# Altium project BinarX Rocket Payload Microcontroller.PrjPcb
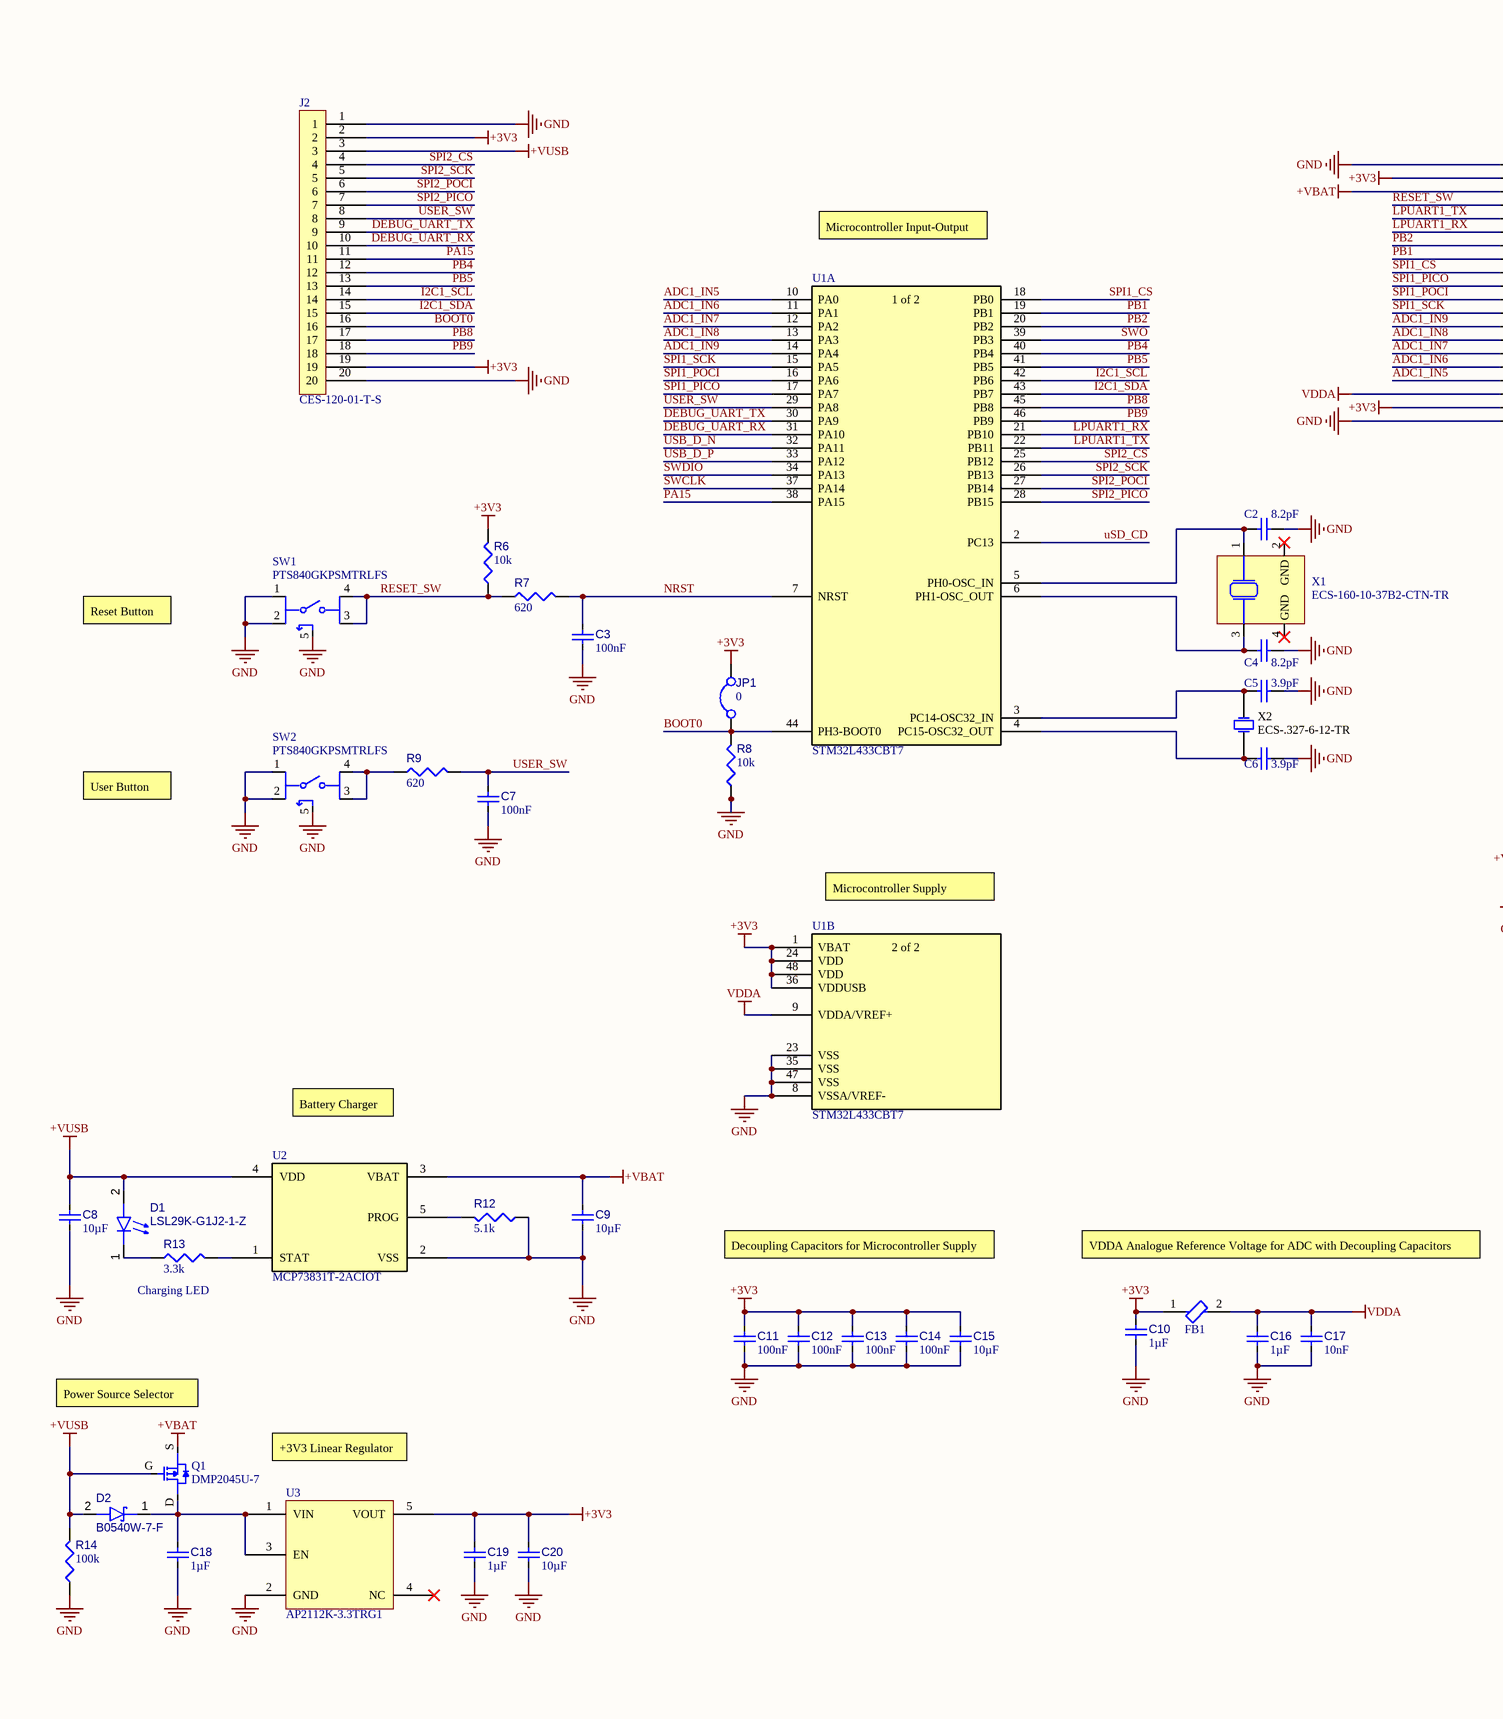
[diagram p0: Microcontroller Board.SchDoc, left]
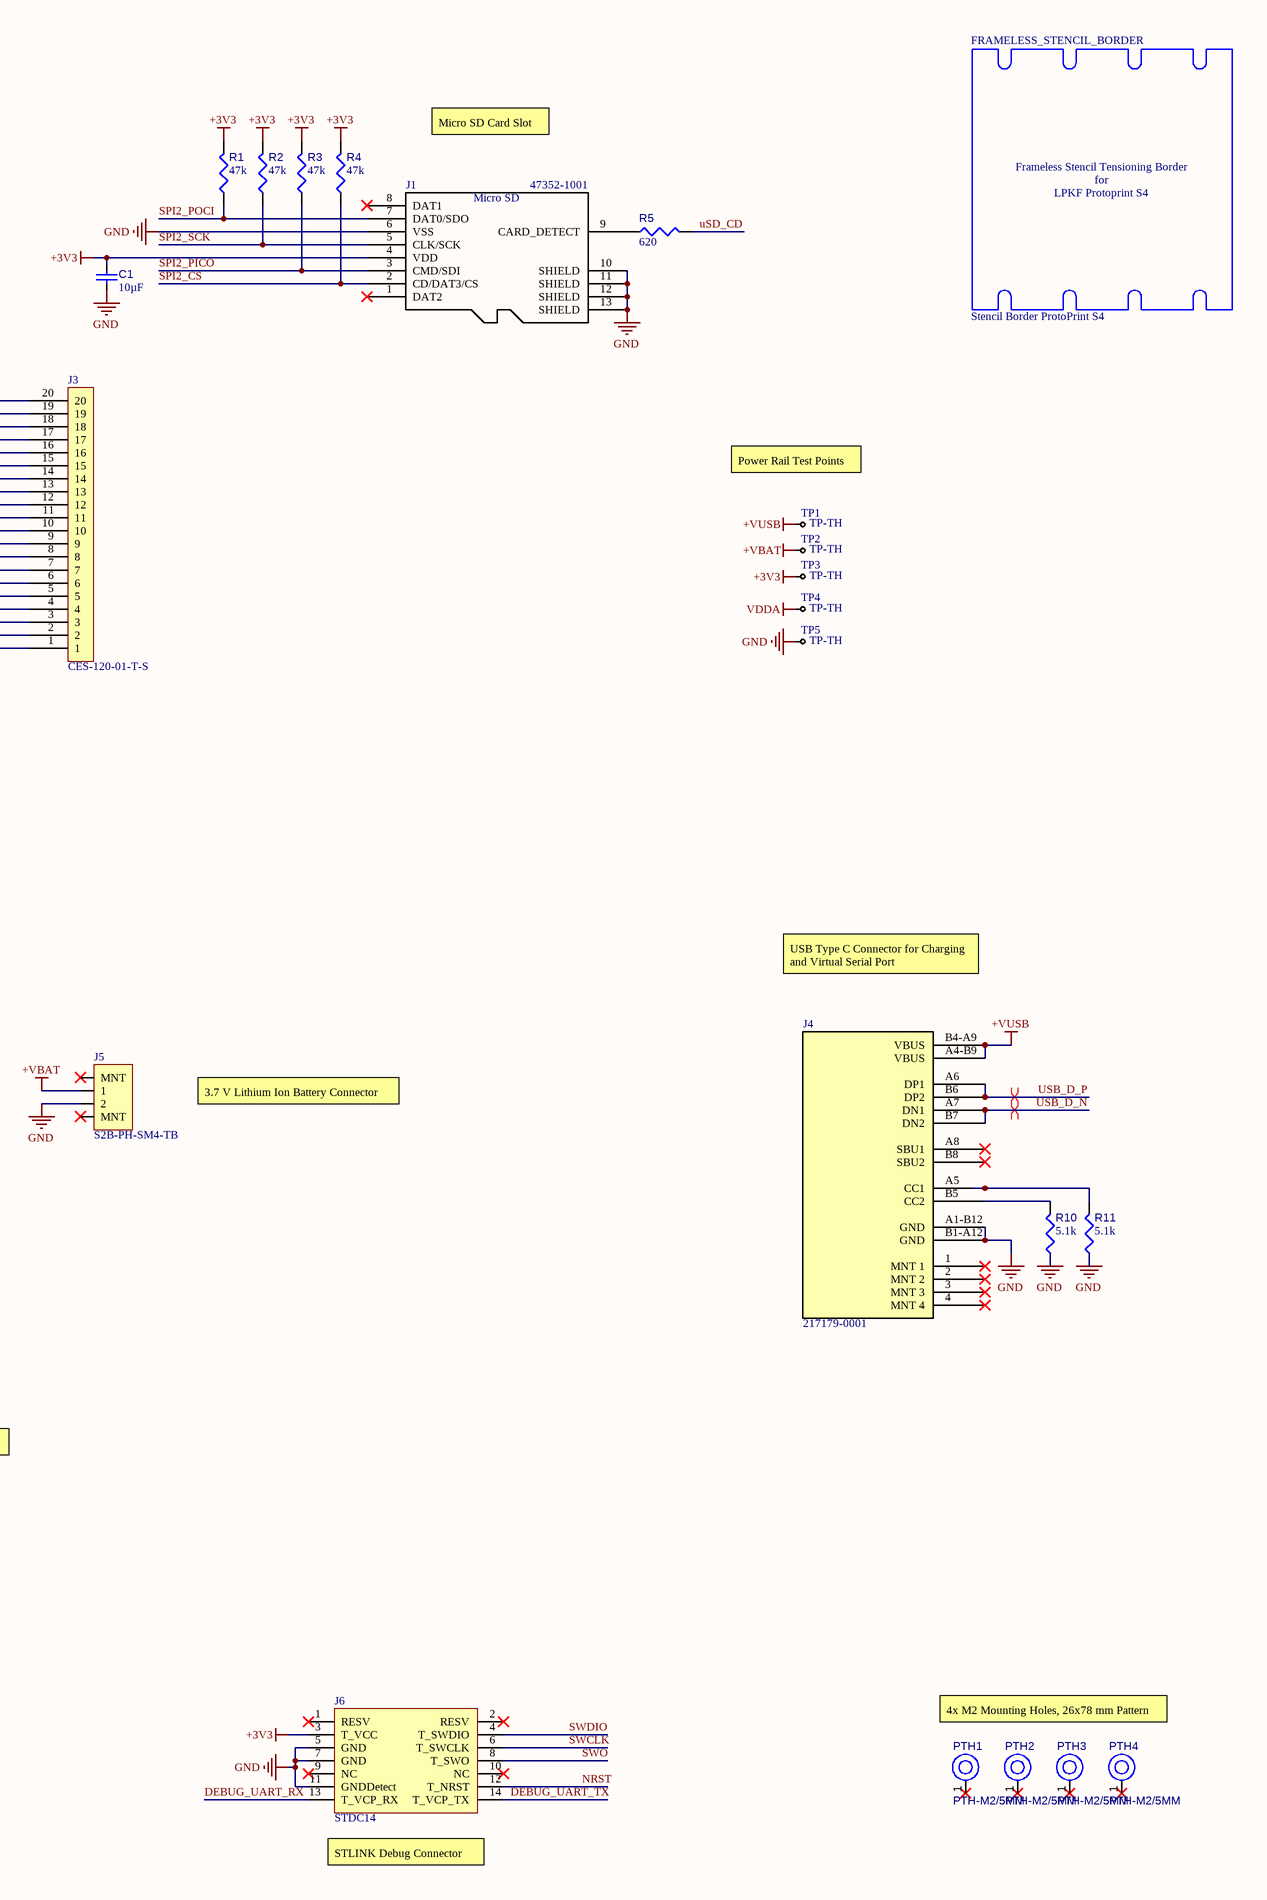
[diagram p1: Microcontroller Board.SchDoc, right]
1 sheet, 62 parts. Net scope: global (net labels, ports and power ports of the same name join across sheets).
Board file: Microcontroller Board.PcbDoc

## Sheet Microcontroller Board.SchDoc
size A2; SheetNumber: 1; SheetTotal: 1

### Parts
C1  value 10µF  [CAPC1608X90X40ML10T20]  (hidden comment: 10 uF +/- 10% 16 V 0603)
C2  value 8.2pF  [CAPC1608X90X40NL10T20]  (hidden comment: Capacitor 8.2 pF 10% 50 V 0603)
C3  value 100nF  [CAPC1608X90X40ML10T20]  (hidden comment: Capacitor 100 nF +/-10% 50 V 0603)
C4  value 8.2pF  [CAPC1608X90X40NL10T20]  (hidden comment: Capacitor 8.2 pF 10% 50 V 0603)
C5  value 3.9pF  [CAPC1608X90X40NL10T20]  (hidden comment: 3.9 pF 10% 50 V 0603)
C6  value 3.9pF  [CAPC1608X90X40NL10T20]  (hidden comment: 3.9 pF 10% 50 V 0603)
C7  value 100nF  [CAPC1608X90X40ML10T20]  (hidden comment: Capacitor 100 nF +/-10% 50 V 0603)
C8  value 10µF  [CAPC1608X90X40ML10T20]  (hidden comment: 10 uF +/- 10% 16 V 0603)
C9  value 10µF  [CAPC1608X90X40ML10T20]  (hidden comment: 10 uF +/- 10% 16 V 0603)
C10  value 1µF  [CAPC1608X90X40ML10T20]  (hidden comment: Capacitor 1 uF +/- 10% 25 V 0603)
C11  value 100nF  [CAPC1608X90X40ML10T20]  (hidden comment: Capacitor 100 nF +/-10% 50 V 0603)
C12  value 100nF  [CAPC1608X90X40ML10T20]  (hidden comment: Capacitor 100 nF +/-10% 50 V 0603)
C13  value 100nF  [CAPC1608X90X40ML10T20]  (hidden comment: Capacitor 100 nF +/-10% 50 V 0603)
C14  value 100nF  [CAPC1608X90X40ML10T20]  (hidden comment: Capacitor 100 nF +/-10% 50 V 0603)
C15  value 10µF  [CAPC1608X90X40ML10T20]  (hidden comment: 10 uF +/- 10% 16 V 0603)
C16  value 1µF  [CAPC1608X90X40ML10T20]  (hidden comment: Capacitor 1 uF +/- 10% 25 V 0603)
C17  value 10nF  [CAPC1608X90X40ML10T20]  (hidden comment: Capacitor 10 nF +/-10% 50 V 0603)
C18  value 1µF  [CAPC1608X90X40ML10T20]  (hidden comment: Capacitor 1 uF +/- 10% 25 V 0603)
C19  value 1µF  [CAPC1608X90X40ML10T20]  (hidden comment: Capacitor 1 uF +/- 10% 25 V 0603)
C20  value 10µF  [CAPC1608X90X40ML10T20]  (hidden comment: 10 uF +/- 10% 16 V 0603)
D1  LSL29K-G1J2-1-Z  [FP-LS_L29K-MFG]
D2  B0540W-7-F  [FP-SOD123-MFG]
FB1  LAMGL160808T471RD  [INDC1608X10M]  (value not drawn)
FRAMELESS_STENCIL_BORDER  Stencil Border ProtoPrint S4  [Frameless Stencil Tensioning Border for LPKF ProtoPrint s4]
J1  47352-1001  [MOLX-473521001_V]
J2  CES-120-01-T-S  [SAMTEC-CES-120-01-X-S]
J3  CES-120-01-T-S  [SAMTEC-CES-120-01-X-S]
J4  217179-0001  [FP-217179-0001-MFG]
J5  S2B-PH-SM4-TB  [JST- S2B-PH-SM4-TB(LF)(SN)-2_V]
J6  STDC14  [FP-FTSH-107-01-L-DV-K]
JP1  value 0  [RESC1608X55X25ML10T15]  (hidden comment: Jumper 0603)
PTH1  PTH-M2/5MM  [PTH-M2]  (no BOM)
PTH2  PTH-M2/5MM  [PTH-M2]  (no BOM)
PTH3  PTH-M2/5MM  [PTH-M2]  (no BOM)
PTH4  PTH-M2/5MM  [PTH-M2]  (no BOM)
Q1  DMP2045U-7  [SOT90P235X110-3M]
R1  value 47k  [RESC1608X55X25ML10T15]  (hidden comment: Resistor 47k +/-1% 0603 100 mW)
R2  value 47k  [RESC1608X55X25ML10T15]  (hidden comment: Resistor 47k +/-1% 0603 100 mW)
R3  value 47k  [RESC1608X55X25ML10T15]  (hidden comment: Resistor 47k +/-1% 0603 100 mW)
R4  value 47k  [RESC1608X55X25ML10T15]  (hidden comment: Resistor 47k +/-1% 0603 100 mW)
R5  value 620  [RESC1608X55X25ML10T15]  (hidden comment: Resistor 620 +/-1% 0603 100 mW)
R6  value 10k  [RESC1608X55X25ML10T15]  (hidden comment: Resistor 10k +/-1% 0603 100 mW)
R7  value 620  [RESC1608X55X25ML10T15]  (hidden comment: Resistor 620 +/-1% 0603 100 mW)
R8  value 10k  [RESC1608X55X25ML10T15]  (hidden comment: Resistor 10k +/-1% 0603 100 mW)
R9  value 620  [RESC1608X55X25ML10T15]  (hidden comment: Resistor 620 +/-1% 0603 100 mW)
R10  value 5.1k  [RESC1608X55X25ML10T15]  (hidden comment: Resistor 5k1 +/-1% 0603 100 mW)
R11  value 5.1k  [RESC1608X55X25ML10T15]  (hidden comment: Resistor 5k1 +/-1% 0603 100 mW)
R12  value 5.1k  [RESC1608X55X25ML10T15]  (hidden comment: Resistor 5k1 +/-1% 0603 100 mW)
R13  value 3.3k  [RESC1608X55X25ML10T15]  (hidden comment: Resistor 3.3k +/-1% 0603 100 mW)
R14  value 100k  [RESC1608X55X25ML10T15]  (hidden comment: Resistor 100k +/-1% 0603 100 mW)
SW1  PTS840GKPSMTRLFS  [FP-PTS840_GKP_SMTR_LFS-MFG]
SW2  PTS840GKPSMTRLFS  [FP-PTS840_GKP_SMTR_LFS-MFG]
TP1  TP-TH  [1 Pin Header Strip Footprint]  (no BOM)
TP2  TP-TH  [1 Pin Header Strip Footprint]  (no BOM)
TP3  TP-TH  [1 Pin Header Strip Footprint]  (no BOM)
TP4  TP-TH  [1 Pin Header Strip Footprint]  (no BOM)
TP5  TP-TH  [1 Pin Header Strip Footprint]  (no BOM)
U1  STM32L433CBT7  [LQFP48-7x7mm]  (parts A,B of 2)
U2  MCP73831T-2ACIOT  [SOT-23-5_MC_MCH-M]
U3  AP2112K-3.3TRG1  [SOT-23-5]
X1  ECS-160-10-37B2-CTN-TR  [DFN135P200X50-4N]
X2  ECS-.327-6-12-TR  [DFN120P200X60-2N]

### Nets
+3V3: C1.2 C10.2 C11.2 C12.2 C13.2 C14.2 C15.2 C19.2 C20.2 FB1.1 J1.4(VDD) J2.2 J2.19 J3.2 J3.19 J6.3(T_VCC) JP1.2 R1.2 R2.2 R3.2 R4.2 R6.2 TP3.1(TP) U1.1(VBAT) U1.24(VDD) U1.36(VDDUSB) U1.48(VDD) U3.5(VOUT)
+VBAT: C9.2 J3.18 J5.1 Q1.S TP2.1(TP) U2.3(VBAT)
+VUSB: C8.2 D1.2(A) D2.2(A) J2.3 J4.A4-B9(VBUS) J4.B4-A9(VBUS) Q1.G R14.2 TP1.1(TP) U2.4(VDD)
GND: C1.1 C2.2 C3.1 C4.2 C5.1 C6.1 C7.1 C8.1 C9.1 C10.1 C11.1 C12.1 C13.1 C14.1 C15.1 C16.1 C17.2 C18.1 C19.1 C20.1 J1.6(VSS) J1.10(SHIELD) J1.11(SHIELD) J1.12(SHIELD) J1.13(SHIELD) J2.1 J2.20 J3.1 J3.20 J4.A1-B12(GND) J4.B1-A12(GND) J5.2 J6.5(GND) J6.7(GND) J6.11(GNDDetect) R8.1 R10.1 R11.1 R12.1 R14.1 SW1.1 SW1.2 SW1.5(GND) SW2.1 SW2.2 SW2.5(GND) TP5.1(TP) U1.8(VSSA/VREF-) U1.23(VSS) U1.35(VSS) U1.47(VSS) U2.2(VSS) U3.2(GND)
VDDA: C16.2 C17.1 FB1.2 J3.3 TP4.1(TP) U1.9(VDDA/VREF+)
ADC1_IN5: J3.4 U1.10(PA0)
ADC1_IN6: J3.5 U1.11(PA1)
ADC1_IN7: J3.6 U1.12(PA2)
ADC1_IN8: J3.7 U1.13(PA3)
ADC1_IN9: J3.8 U1.14(PA4)
BOOT0: J2.16 JP1.1 R8.2 U1.44(PH3-BOOT0)
DEBUG_UART_RX: J2.10 J6.13(T_VCP_RX) U1.31(PA10)
DEBUG_UART_TX: J2.9 J6.14(T_VCP_TX) U1.30(PA9)
I2C1_SCL: J2.14 U1.42(PB6)
I2C1_SDA: J2.15 U1.43(PB7)
LPUART1_RX: J3.15 U1.21(PB10)
LPUART1_TX: J3.16 U1.22(PB11)
NRST: C3.2 J6.12(T_NRST) R7.2 U1.7(NRST)
PA15: J2.11 U1.38(PA15)
PB1: J3.13 U1.19(PB1)
PB2: J3.14 U1.20(PB2)
PB4: J2.12 U1.40(PB4)
PB5: J2.13 U1.41(PB5)
PB8: J2.17 U1.45(PB8)
PB9: J2.18 U1.46(PB9)
RESET_SW: J3.17 R6.1 R7.1 SW1.3 SW1.4
SPI1_CS: J3.12 U1.18(PB0)
SPI1_PICO: J3.11 U1.17(PA7)
SPI1_POCI: J3.10 U1.16(PA6)
SPI1_SCK: J3.9 U1.15(PA5)
SPI2_CS: J1.2(CD/DAT3/CS) J2.4 R4.1 U1.25(PB12)
SPI2_PICO: J1.3(CMD/SDI) J2.7 R3.1 U1.28(PB15)
SPI2_POCI: J1.7(DAT0/SDO) J2.6 R1.1 U1.27(PB14)
SPI2_SCK: J1.5(CLK/SCK) J2.5 R2.1 U1.26(PB13)
SWCLK: J6.6(T_SWCLK) U1.37(PA14)
SWDIO: J6.4(T_SWDIO) U1.34(PA13)
SWO: J6.8(T_SWO) U1.39(PB3)
USB_D_N: J4.A7(DN1) J4.B7(DN2) U1.32(PA11)
USB_D_P: J4.A6(DP1) J4.B6(DP2) U1.33(PA12)
uSD_CD: R5.2 U1.2(PC13)
USER_SW: C7.2 J2.8 R9.2 U1.29(PA8)
NetC2_1: C2.1 U1.5(PH0-OSC_IN) X1.1(XTAL1)
NetC4_1: C4.1 U1.6(PH1-OSC_OUT) X1.3(XTAL2)
NetC5_2: C5.2 U1.3(PC14-OSC32_IN) X2.2
NetC6_2: C6.2 U1.4(PC15-OSC32_OUT) X2.1
NetC18_2: C18.2 D2.1(K) Q1.D U3.1(VIN) U3.3(EN)
NetD1_1: D1.1(K) R13.1
NetJ1_9: J1.9(CARD_DETECT) R5.1
NetJ4_A5: J4.A5(CC1) R11.2
NetJ4_B5: J4.B5(CC2) R10.2
NetR9_1: R9.1 SW2.3 SW2.4
NetR12_2: R12.2 U2.5(PROG)
NetR13_2: R13.2 U2.1(STAT)

Not connected (* = marked no-connect by the designer): J1 1(DAT2)* 8(DAT1)*; J4 1(MNT_1)* 2(MNT_2)* 3(MNT_3)* 4(MNT_4)* A8(SBU1)* B8(SBU2)*; J5 MNT1(MNT)* MNT2(MNT)*; J6 1(RESV)* 2(RESV)* 9(NC)* 10(NC)*; PTH1 1(H1)*; PTH2 1(H1)*; PTH3 1(H1)*; PTH4 1(H1)*; U3 4(NC)*; X1 2(GND)* 4(GND)*

### Layout directives
differential pair: USB_D_N, USB_D_P

### Notes on the sheet
- Micro SD Card Slot
- Microcontroller Input-Output
- Power Rail Test Points
- Reset Button
- User Button
- USB Type C Connector for Charging and Virtual Serial Port
- (near U1) Microcontroller Supply
- 3.7 V Lithium Ion Battery Connector
- Battery Charger
- Decoupling Capacitors for Microcontroller Supply
- VDDA Analogue Reference Voltage for ADC with Decoupling Capacitors
- Charging LED
- (near Q1) Power Source Selector
- +3V3 Linear Regulator
- 4x M2 Mounting Holes, 26x78 mm Pattern
- (near J6) STLINK Debug Connector
- (in symbol CMP-002-00147-7) Micro SD
- (in symbol CMP-00030-00001-2) Frameless Stencil Tensioning Border; for; LPKF Protoprint S4
- (in symbol CMP-104-000000-10, part A) 1 of 2
- (in symbol CMP-104-000000-10, part B) 2 of 2

### Library data of the parts
C1 C8 C9 C15 C20 = CMP-001-00138-1: Chip Capacitor, 10 uF, +/-10%, 16 V, 0603(1608 Metric); Capacitor Type: Ceramic; Voltage Rating: 16V; Max Operating Temperature: 85°C; Pins: 2; Mounting Technology: Surface Mount; Tolerance: 10%; RoHS Compliant: True; Min Operating Temperature: -55°C; Case/Package: 0603
C2 C4 = CMP-001-00139-1: Chip Capacitor, 8.2 pF, 10%, 50 V, 0603 (1608 Metric); Capacitor Type: Ceramic; Voltage Rating: 50V; Pins: 2; Tolerance: 10%; Min Operating Temperature: -55°C; RoHS Compliant: Yes; Case/Package: 0603; Created By: Robert Howie; Max Operating Temperature: 125°C; Mounting Technology: Surface Mount
C3 C7 C11-C14 = CMP-00004-1: Chip Capacitor, 100 nF, +/- 10%, 50 V, 0603 (1608 Metric); Voltage Rating: 50V; Capacitor Type: Ceramic; Pins: 2; Mounting Technology: SM; Case/Package: 0603; Min Operating Temperature: -55°C; RoHS Compliant: True; Tolerance: 10%; Max Operating Temperature: 125°C
C5 C6 = CMP-001-00136-1: Chip Capacitor, 3.9 pF, 10%, 50 V, 0603 (1608 Metric); Capacitor Type: Ceramic; Voltage Rating: 50V; Min Operating Temperature: -55°C; Max Operating Temperature: 125°C; Case/Package: 0603; Created By: Robert Howie; Pins: 2; Tolerance: 10%; Mounting Technology: Surface Mount; RoHS Compliant: Yes
C10 C16 C18 C19 = CMP-00009-1: Chip Capacitor, 1 uF, +/-10%, 25 V, 0603(1608 Metric); Capacitor Type: Ceramic; Voltage Rating: 25V; Max Operating Temperature: 125°C; Case/Package: 0603; RoHS Compliant: True; Min Operating Temperature: -55°C; Pins: 2; Tolerance: 10%; Mounting Technology: SM
C17 = CMP-001-00137-1: Chip Capacitor, 10 nF, +/- 10%, 50 V, 0603 (1608 Metric); Voltage Rating: 50V; Capacitor Type: Ceramic; Max Operating Temperature: 125°C; Case/Package: 0603; Created By: Robert Howie; Tolerance: 10%; Min Operating Temperature: -55°C; RoHS Compliant: Yes; Pins: 2; Mounting Technology: Surface Mount
D1 = CMP-007-00038-4: LED Red, Diffused, 0603, 2mA
D2 = CMP-004-00044-1: Rectifier Diode, Schottky, 1 Phase, 1 Element, 0.5A, 40V V(RRM), Silicon; Forward Voltage: 460mV; RoHS Compliant: Yes; Max Operating Temperature: 150°C; Min Operating Temperature: -65°C; Pins: 2
FB1 = CMP-00008-1: Ferrite Bead 0603 470ohm 25% AEC-Q200; Z Measuring Frequency: 100MHz; Max Current Rating: 680mA; Min Operating Temperature: -40°C; Impedance: 470ohm; Created By: Robert Howie; Mount: Surface Mount; Case/Package: 0603; ComponentLink1URL: https://ds.yuden.co.jp/TYCOMPAS/ut/detail?pn=LAMGL160808T471RD&u=M; Max Operating Temperature: 150°C; Tolerance: 25%; Series: FB; ComponentLink1Description: Manufacturer Page; Ratings: AEC-Q200
FRAMELESS_STENCIL_BORDER = CMP-00030-00001-2: Frameless stencil tensioning border for LPKF ProtoPrint S4; Created By: Robert Howie
J1 = CMP-002-00147-7: 1.10mm Pitch microSD Card Connector, Push-Push Type, with VSS (Supply Voltage Ground) Detect Switch, Lead-Free; Connector Type: PCB; RoHS Compliant: Yes; Max Operating Temperature: 85°C; Min Operating Temperature: -20°C; Mounting Technology: Board; Created By: Robert Howie
J2 J3 = CMP-002-00149-8: Board-To-Board Connector, Single, Ces Series, Through Hole, Receptacle, 20, 2.54 Mm Rohs Compliant: Yes; Voltage Rating: 333V; Max Current Rating: 1A; Min Operating Temperature: -55°C; Created By: Robert Howie; Gender: Receptacle; Max Operating Temperature: 105°C; Connector Type: Receptacle; RoHS Compliant: Yes; Mounting Technology: Through Hole
J4 = CMP-002-00144-10: USB Type C - Connector, Top-mount SMT, 16pos; Voltage Rating: 30V; Gender: Female; Max Current Rating: 2.5A; Connector Type: USB Type-C 2.0; ComponentLink1Description: Manufacturer's Product Page; RoHS Compliant: Yes; Pins: 16; Min Operating Temperature: -40°C; Created By: Robert Howie; Max Operating Temperature: 85°C; Mounting Technology: SMT; ComponentLink1URL: https://www.molex.com/en-us/products/part-detail/2171790001
J5 = CMP-002-00145-3: Connector Header, PH Series, 2 Position, Side Entry, 2.00mm, Solder, Surface Mount, Natural
J6 = CMP-049-000000-6: STDC14 for STLINK Programmer; Source: STDC14.SchLib; Design Item ID: CMP-002-00076-5; ComponentLink1URL: https://www.st.com/en/development-tools/stlink-v3mini.html#overview; RoHS Compliant: Yes; ComponentLink1Description: Manufacturer Link; Mounting Technology: Board
JP1 = CMP-00010-5: Max Operating Temperature: 155°C; Case/Package: 0603; Min Operating Temperature: -55°C; Pins: 2
PTH1-PTH4 = CMP-00012-2: M2 Clearance (2.2 mm) Plated Through Hole, 5mm Diameter Pad; Pins: 1; Created By: Robert Howie
Q1 = CMP-013-00047-1: Small Signal Field-Effect Transistor, 3.8A I(D), 20V, 1-Element, P-Channel, Silicon, Metal-oxide Semiconductor FET with ESD Protected Gate; Nominal Vgs: -1.8V; Case/Package: SOT23; Pins: 3; RoHS Compliant: Yes
R1-R4 = CMP-009-00267-4: Chip Resistor, 47 KOhm, +/- 1%, 01 W, -55 to 155 degC, 0603 (1608 Metric); Power: 100mW; Voltage Rating: 50V; Mounting Technology: Surface Mount; Tolerance: 1%; RoHS Compliant: Yes; Min Operating Temperature: -55°C; Case/Package: 0603; Pins: 2; Max Operating Temperature: 155°C; Created By: Robert Howie
R5 R7 R9 = CMP-00011-5: Chip Resistor, 620 Ohm, +/-1%, 0.1 W, -55 to 155 degC, 0603 (1608 Metric); Tolerance: 1%; Power: 100mW; Mounting Technology: SM; RoHS Compliant: Yes; Min Operating Temperature: -55°C; Pins: 2; Created By: Robert Howie; Max Operating Temperature: 155°C; Case/Package: 0603
R6 R8 = CMP-00007-6: Chip Resistor, 10 KOhm, +/- 1%, 01 W, -55 to 155 degC, 0603 (1608 Metric); Voltage Rating: 50V; Power: 100mW; Mounting Technology: Surface Mount; Tolerance: 1%; Pins: 2; Max Operating Temperature: 155°C; Case/Package: 0603; Min Operating Temperature: -55°C; RoHS Compliant: Yes
R10-R12 = CMP-009-00265-2: Chip Resistor, 5.1 KOhm, +/- 1%, 0.1 W, -55 to 155 degC, 0603 (1608 Metric); Power: 100mW; Max Operating Temperature: 155°C; Pins: 2; Min Operating Temperature: -55°C; Mounting Technology: Surface Mount; Tolerance: 1%; Created By: Robert Howie; RoHS Compliant: Yes; Case/Package: 0603
R13 = CMP-009-00268-2: Chip Resistor, 3.3 kOhm, +/- 1%, 100 mW, -55 to 155 degC, 0603 (1608 Metric); Power: 100mW; Voltage Rating: 75V; Tolerance: 1%; RoHS Compliant: Yes; Case/Package: 0603; Mounting Technology: Surface Mount; Max Operating Temperature: 155°C; Pins: 2; Min Operating Temperature: -55°C
R14 = CMP-009-00266-2: Chip Resistor, 100 KOhm, +/- 1%, 0.1 W, -55 to 155 degC, 0603 (1608 Metric); Power: 100mW; Voltage Rating: 75V; Max Operating Temperature: 155°C; Tolerance: 1%; Min Operating Temperature: -55°C; Created By: Robert Howie; RoHS Compliant: Yes; Case/Package: 0603; Pins: 2; Mounting Technology: Surface Mount
SW1 SW2 = CMP-011-00022-2: Keypad Switch, 1 Switches, SPST, Momentary-tactile, 0.05A, 12VDC, 2.94N, Solder Terminal, Surface Mount-right Angle; RoHS Compliant: Yes; Min Operating Temperature: -40°C; Max Operating Temperature: 85°C; Mounting Technology: Surface Mount; Created By: Robert Howie
TP1-TP5 = CMP-097-000000-3: Throughole Test Point; Created By: Robert Howie; Source: Components - 10.08.23 - 09.25.SchLib; Design Item ID: CMP-001-0001-5
U1 = CMP-104-000000-10: Ultra-low-power with FPU Arm Cortex-M4 MCU 80 MHz with 128 Kbytes of Flash memory, USB FS, LCD; Mfr_Name: STMicroelectronics; Design Item ID: STM32L433CBT7; RefDes: RefDes; Type: DEV; Source: STM32L433CBT7.SchLib; Manufacturer_Part_Number: STM32L433CBT7; Created By: Robert Howie
U2 = CMP-106-000000-6: Single Cell, Li-Ion/Li-Polymer Charge Management Controller; Manufacturer_Part_Number: MCP73831T-2ACI/OT; Mfr_Name: Microchip; Max Supply Voltage: 6V; Min Supply Voltage: 3.75V; Case/Package: LSSOP; Max Operating Temperature: 85°C; Source: MCP73831T-2ACIOT.SchLib; Type: DEV; Created By: Robert Howie; RoHS Compliant: Yes; Pins: 5; RefDes: RefDes; Min Operating Temperature: -40°C; Copyright: Copyright (C) 2023 Ultra Librarian. All rights reserved.; Design Item ID: MCP73831T-2ACIOT
U3 = CMP-019-00088-3: Fixed Positive LDO Regulator, 3.3V, 0.4V Dropout, CMOS, PDSO5; Max Supply Voltage: 6V; Min Operating Temperature: -40°C; RoHS Compliant: Yes; Case/Package: SOT25; Pins: 5; Max Operating Temperature: 85°C
X1 = CMP-003-00037-4: Crystal 16MHz 10pF 4-Pin SMD ECX-1637B2 T/R; Pins: 4; Frequency: 16MHz; Case/Package: 2.0 x 1.6 x 0.45 mm ceramic package; Mounting Technology: SMT; Load Capacitance: 10pF
X2 = CMP-003-00039-1: Parallel - Fundamental Quartz Crystal, 0.032768MHz Nom; Load Capacitance: 6pF; ESR: 90k; Mounting Technology: Surface Mount; Min Operating Temperature: -40°C; RoHS Compliant: Yes; Max Operating Temperature: 85°C

## Assembly variants
Populated Components Only: not fitted JP1 JP2 JP3